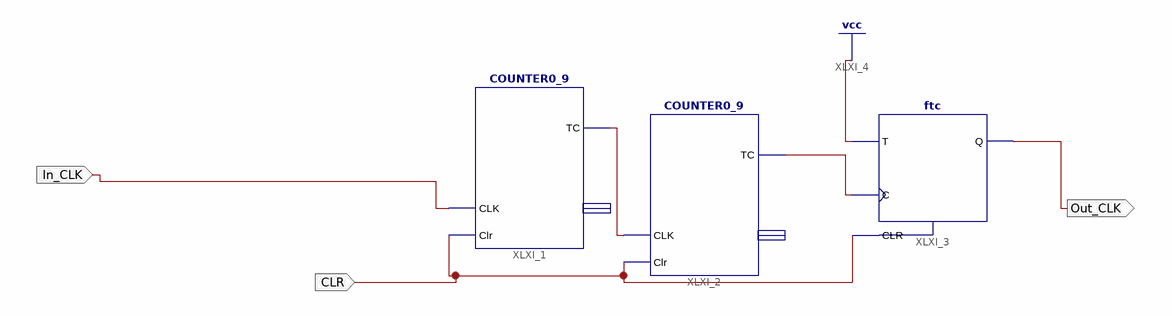
[diagram p0: schematic sheet 1]
// Xilinx ISE schematic Div200.sch (spartan6) as structural Verilog: 3 symbols, 3 ports
module Div200 (
  input  In_CLK,
  input  CLR,
  output Out_CLK
);

  wire XLXN_1, XLXN_2;

  COUNTER0_9 XLXI_1 (.CLK(In_CLK), .Clr(CLR), .TC(XLXN_1));  // open: bit
  COUNTER0_9 XLXI_2 (.CLK(XLXN_1), .Clr(CLR), .TC(XLXN_2));  // open: bit
  ftc XLXI_3 (.C(XLXN_2), .CLR(CLR), .T(1'b1), .Q(Out_CLK));
endmodule
